# Altium schematic sheet nRF52840.SchDoc
size A3
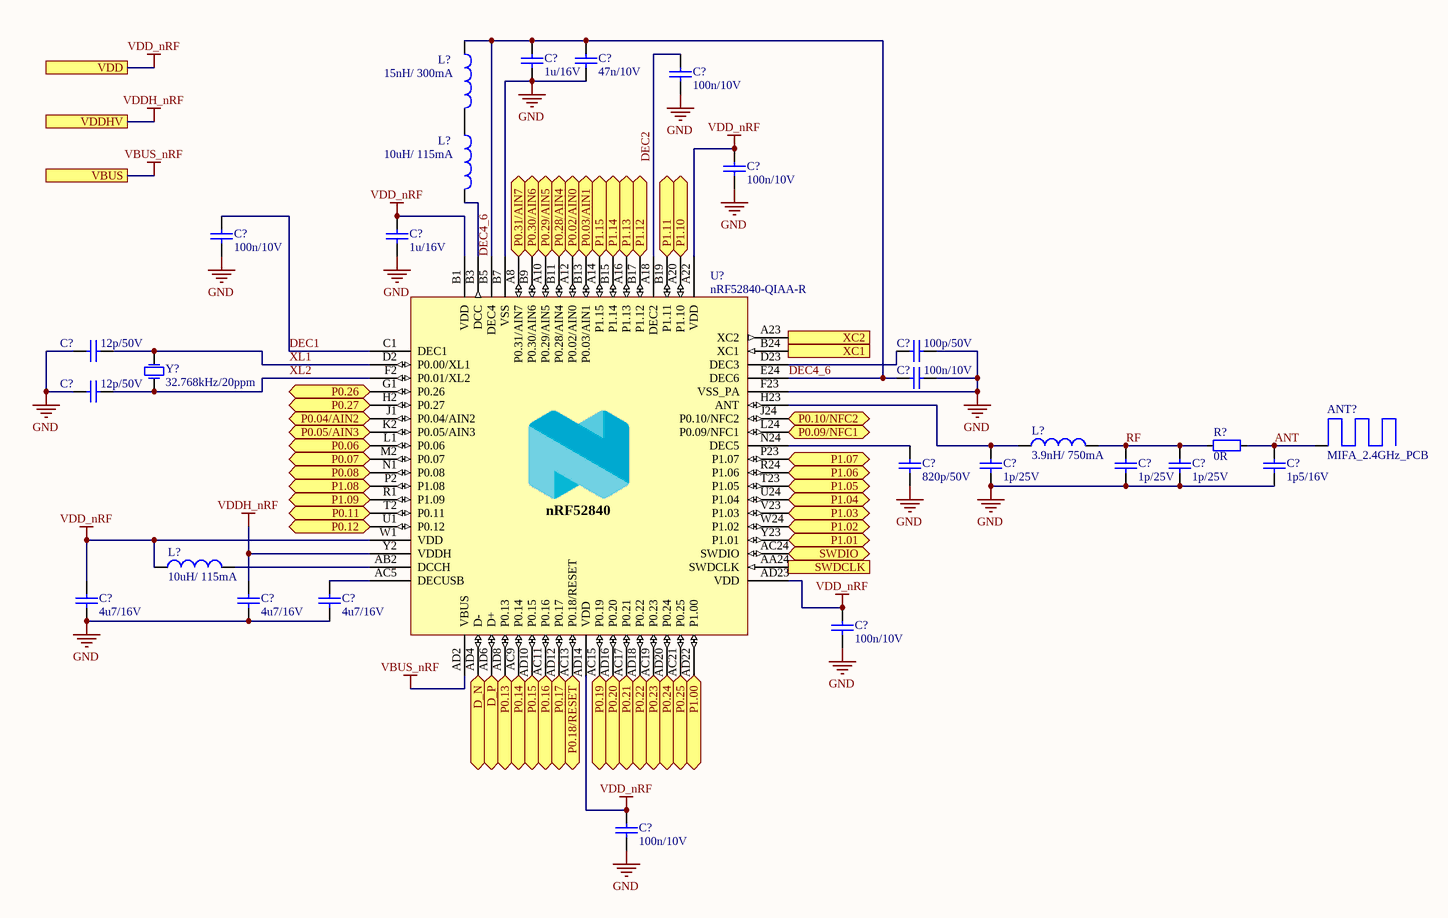
[diagram p0: nRF52840.SchDoc]

## Parts
(Parts that share a designator on the sheet are numbered #1, #2 ... from top to bottom, then left to right.)
ANT?  MIFA_2.4GHz_PCB  [MIFA_2.4GHz_PCB2]  (net tie, no BOM)
C?#1  1u/16V  [C0603]
C?#2  47n/10V  [C0402]
C?#3  100n/10V  [C0402]
C?#4  100n/10V  [C0402]
C?#5  100n/10V  [C0402]
C?#6  1u/16V  [C0603]
C?#7  12p/50V  [C0402]
C?#8  100p/50V  [C0402]
C?#9  100n/10V  [C0402]
C?#10  12p/50V  [C0402]
C?#11  820p/50V  [C0402]
C?#12  1p/25V  [C0402]
C?#13  1p/25V  [C0402]
C?#14  1p/25V  [C0402]
C?#15  1p5/16V  [C0402]
C?#16  4u7/16V  [C0805]
C?#17  4u7/16V  [C0805]
C?#18  4u7/16V  [C0805]
C?#19  100n/10V  [C0402]
C?#20  100n/10V  [C0402]
L?#1  15nH/ 300mA  [L0402]
L?#2  10uH/ 115mA  [L0603]
L?#3  3.9nH/ 750mA  [L0402]
L?#4  10uH/ 115mA  [L0603]
R?  0R  [R0402]
U?  nRF52840-QIAA-R  [AQFN50P700X700X85_HS-74N]
Y?  32.768kHz/20ppm  [CFPX-217]

## Ports
D_N (bidir), D_P (bidir), P0.02/AIN0 (bidir), P0.03/AIN1 (bidir), P0.04/AIN2 (bidir), P0.05/AIN3 (bidir), P0.06 (bidir), P0.07 (bidir), P0.08 (bidir), P0.09/NFC1 (bidir), P0.10/NFC2 (bidir), P0.11 (bidir), P0.12 (bidir), P0.13 (bidir), P0.14 (bidir), P0.15 (bidir), P0.16 (bidir), P0.17 (bidir), P0.18/RESET (bidir), P0.19 (bidir), P0.20 (bidir), P0.21 (bidir), P0.22 (bidir), P0.23 (bidir), P0.24 (bidir), P0.25 (bidir), P0.26 (bidir), P0.27 (bidir), P0.28/AIN4 (bidir), P0.29/AIN5 (bidir), P0.30/AIN6 (bidir), P0.31/AIN7 (bidir), P1.00 (bidir), P1.01 (bidir), P1.02 (bidir), P1.03 (bidir), P1.04 (bidir), P1.05 (bidir), P1.06 (bidir), P1.07 (bidir), P1.08 (bidir), P1.09 (bidir), P1.10 (bidir), P1.11 (bidir), P1.12 (bidir), P1.13 (bidir), P1.14 (bidir), P1.15 (bidir), SWDCLK (in), SWDIO (bidir), VBUS, VDD, VDDHV, XC1 (in), XC2 (out)

## Nets
GND: C?#1.1 C?#2.1 C?#3.1 C?#4.1 C?#5.2 C?#6.1 C?#7.1 C?#8.2 C?#9.1 C?#10.1 C?#11.1 C?#12.1 C?#13.1 C?#14.1 C?#15.1 C?#16.1 C?#17.1 C?#18.1 C?#19.1 C?#20.1 U?.74(GND) U?.B7(VSS) U?.F23(VSS_PA)
VBUS_nRF: U?.AD2(VBUS) ; port VBUS
VDD_nRF: C?#4.2 C?#6.2 C?#16.2 C?#19.2 C?#20.2 L?#4.1 U?.A22(VDD) U?.AD14(VDD) U?.AD23(VDD) U?.B1(VDD) U?.W1(VDD) ; port VDD
VDDH_nRF: C?#17.2 U?.Y2(VDDH) ; port VDDHV
ANT: ANT?.1 C?#15.2 R?.2
D_N: U?.AD4(D-) ; port D_N
D_P: U?.AD6(D+) ; port D_P
DEC1: C?#5.1 U?.C1(DEC1)
DEC2: C?#3.2 U?.A18(DEC2)
DEC4_6: C?#1.2 C?#2.2 C?#9.2 L?#1.1 U?.B5(DEC4) U?.E24(DEC6)
P0.02/AIN0: U?.A12(P0.02/AIN0) ; port P0.02/AIN0
P0.03/AIN1: U?.B13(P0.03/AIN1) ; port P0.03/AIN1
P0.04/AIN2: U?.J1(P0.04/AIN2) ; port P0.04/AIN2
P0.05/AIN3: U?.K2(P0.05/AIN3) ; port P0.05/AIN3
P0.06: U?.L1(P0.06) ; port P0.06
P0.07: U?.M2(P0.07) ; port P0.07
P0.08: U?.N1(P0.08) ; port P0.08
P0.09/NFC1: U?.L24(P0.09/NFC1) ; port P0.09/NFC1
P0.10/NFC2: U?.J24(P0.10/NFC2) ; port P0.10/NFC2
P0.11: U?.T2(P0.11) ; port P0.11
P0.12: U?.U1(P0.12) ; port P0.12
P0.13: U?.AD8(P0.13) ; port P0.13
P0.14: U?.AC9(P0.14) ; port P0.14
P0.15: U?.AD10(P0.15) ; port P0.15
P0.16: U?.AC11(P0.16) ; port P0.16
P0.17: U?.AD12(P0.17) ; port P0.17
P0.18/RESET: U?.AC13(P0.18/RESET) ; port P0.18/RESET
P0.19: U?.AC15(P0.19) ; port P0.19
P0.20: U?.AD16(P0.20) ; port P0.20
P0.21: U?.AC17(P0.21) ; port P0.21
P0.22: U?.AD18(P0.22) ; port P0.22
P0.23: U?.AC19(P0.23) ; port P0.23
P0.24: U?.AD20(P0.24) ; port P0.24
P0.25: U?.AC21(P0.25) ; port P0.25
P0.26: U?.G1(P0.26) ; port P0.26
P0.27: U?.H2(P0.27) ; port P0.27
P0.28/AIN4: U?.B11(P0.28/AIN4) ; port P0.28/AIN4
P0.29/AIN5: U?.A10(P0.29/AIN5) ; port P0.29/AIN5
P0.30/AIN6: U?.B9(P0.30/AIN6) ; port P0.30/AIN6
P0.31/AIN7: U?.A8(P0.31/AIN7) ; port P0.31/AIN7
P1.00: U?.AD22(P1.00) ; port P1.00
P1.01: U?.Y23(P1.01) ; port P1.01
P1.02: U?.W24(P1.02) ; port P1.02
P1.03: U?.V23(P1.03) ; port P1.03
P1.04: U?.U24(P1.04) ; port P1.04
P1.05: U?.T23(P1.05) ; port P1.05
P1.06: U?.R24(P1.06) ; port P1.06
P1.07: U?.P23(P1.07) ; port P1.07
P1.08: U?.P2(P1.08) ; port P1.08
P1.09: U?.R1(P1.09) ; port P1.09
P1.10: U?.A20(P1.10) ; port P1.10
P1.11: U?.B19(P1.11) ; port P1.11
P1.12: U?.B17(P1.12) ; port P1.12
P1.13: U?.A16(P1.13) ; port P1.13
P1.14: U?.B15(P1.14) ; port P1.14
P1.15: U?.A14(P1.15) ; port P1.15
RF: C?#13.2 C?#14.2 L?#3.2 R?.1
SWDCLK: U?.AA24(SWDCLK) ; port SWDCLK
SWDIO: U?.AC24(SWDIO) ; port SWDIO
XC1: U?.B24(XC1) ; port XC1
XC2: U?.A23(XC2) ; port XC2
XL1: C?#7.2 U?.D2(P0.00/XL1) Y?.2
XL2: C?#10.2 U?.F2(P0.01/XL2) Y?.1
NetC?#8_1: C?#8.1 U?.D23(DEC3)
NetC?#11_2: C?#11.2 U?.N24(DEC5)
NetC?#12_2: C?#12.2 L?#3.1 U?.H23(ANT)
NetC?#18_2: C?#18.2 U?.AC5(DECUSB)
NetL?#1_2: L?#1.2 L?#2.1
NetL?#2_2: L?#2.2 U?.B3(DCC)
NetL?#4_2: L?#4.2 U?.AB2(DCCH)

## Notes on the sheet
- Title
- Date:
- Number:
- Revision:
- Sheet
- of
- File:
- Author
- (in symbol nRF52840_QIAA) nRF52840

## Library data of the parts
ANT? = MIFA_2.4GHz_PCB2: Meandered Inverted-F Antenna (MIFA)
C?#1 C?#6 = 1u 16V X7R 0603: Manufacturer Part Number 1: 885012206052; Manufacturer 1: Wurth Elektronik; Voltage: 16V; Tolerance: 10%; Specifications: X7R 1u 16V ±10%; Capacitance: 1u; Dielectric: X7R; Supplier 1: Mouser; Supplier Part Number 1: 710-885012206052
C?#2 = 47n 10V Y5V 0402: Manufacturer Part Number 1: 0402F474Z100CT; Manufacturer 1: Walsin; Voltage: 10V; Tolerance: 20%; Specifications: Y5V 47n 10V ±20%; Capacitance: 47n; Dielectric: Y5V; Supplier 1: Farnell; Supplier Part Number 1: 2524745
C?#3-C?#5 C?#9 C?#19 C?#20 = 100n 10V X5R 0402: Manufacturer Part Number 1: 885012105010; Manufacturer 1: Wurth Elektronik; Voltage: 10V; Tolerance: 20%; Specifications: X5R 100n 10V ±20%; Capacitance: 100n; Dielectric: X5R; Supplier 1: Mouser; Supplier Part Number 1: 710-885012105010
C?#7 C?#10 = 12p 50V NPO 0402: Manufacturer Part Number 1: CC0402JRNPO9BN120; Manufacturer 1: Yageo; Voltage: 50V; Tolerance: 5%; Specifications: NPO 12p 50V ±5%; Capacitance: 12p; Dielectric: NPO; Supplier 1: Mouser; Supplier Part Number 1: 603-CC402JRNPO9BN120
C?#8 = 100p 50V C0G 0402: Manufacturer Part Number 1: MC0402N101K500CT; Manufacturer 1: Multicomp PRO; Voltage: 50V; Tolerance: 10%; Specifications: C0G 100p 50V ±10%; Capacitance: 100p; Dielectric: C0G; Supplier 1: Farnell; Supplier Part Number 1: 2320762
C?#11 = 820p 50V X7R 0402: Manufacturer Part Number 1: MC0402B821K500CT; Manufacturer 1: Multicomp PRO; Voltage: 50V; Tolerance: 10%; Specifications: X7R 820p 50V ±10%; Capacitance: 820p; Dielectric: X7R; Supplier 1: Farnell; Supplier Part Number 1: 1758990
C?#12-C?#14 = 1p 25V C0G 0402: Manufacturer Part Number 1: 885012005034; Manufacturer 1: Wurth Elektronik; Voltage: 25V; Tolerance: 0.5pF; Specifications: C0G 1p 25V ±0.5pF; Capacitance: 1p; Dielectric: C0G; Supplier 1: Farnell; Supplier Part Number 1: 2533789
C?#15 = 1p5 1V C0G 0402: Manufacturer Part Number 1: 885012005020; Manufacturer 1: Wurth Elektronik; Voltage: 16V; Tolerance: 0.5pF; Specifications: C0G 1p5 16V ±0.5pF; Capacitance: 1p5; Dielectric: C0G; Supplier 1: Farnell; Supplier Part Number 1: 2812064
C?#16-C?#18 = 4u7 16V X7R 0805: Manufacturer Part Number 1: EMK212AB7475KGHT; Manufacturer 1: Taiyo Yuden; Voltage: 16V; Tolerance: 10%; Specifications: X7R 4u7 16V ±10%; Capacitance: 4u7; Dielectric: X7R; Supplier 1: Mouser; Supplier Part Number 1: 963-EMK212AB7475KGHT
L?#1 = HK100515NJ-T: Fixed Inductors 0402 15nH 460mOhms +/-5%Tol 300mA HiQ; Manufacturer 1: Taiyo Yuden; Tolerance: 5%; Specifications: 15nH 300mA 5%; ComponentLink1Description: Datasheet; ComponentLink1URL: https://www.mouser.co.uk/datasheet/2/396/mlci04_e-1396612.pdf; Inductance: 15nH; Current: 300mA; Manufacturer Part Number 1: HK100515NJ-T; Supplier 1: Mouser; Supplier Part Number 1: 963-HK100515NJ-T
L?#2 L?#4 = L0603B100KDWFT: Fixed Inductors 10uH 10% Wound Chip; Manufacturer 1: Kemet; Specifications: 10uH 115mA 10%; ComponentLink1Description: Datasheet; ComponentLink1URL: https://www.mouser.co.uk/datasheet/2/212/F3115-1104303.pdf; Inductance: 10uH; Tolerance: 10%; Current: 115mA; Manufacturer Part Number 1: L0603B100KDWFT; Supplier 1: Mouser; Supplier Part Number 1: 80-L0603B100KDWFT
L?#3 = LQG15HS3N9C02D: Fixed Inductors 0402 3.9nH 0.2nH 750mA .14ohms 6.0GHz; Manufacturer 1: Murata Electronics; Specifications: 3.9nH 750mA 0.2nH; ComponentLink1Description: Datasheet; ComponentLink1URL: https://www.mouser.co.uk/datasheet/2/281/JELF243B-0010-1699614.pdf; Inductance: 3.9nH; Tolerance: 0.2nH; Current: 750mA; Manufacturer Part Number 1: LQG15HS3N9C02D; Supplier 1: Mouser; Supplier Part Number 1: 81-LQG15HS3N9C02D
R? = 0R 63mW 50V 0402: Manufacturer Part Number 1: CRCW04020000Z0EDC; Manufacturer 1: Vishay; Power Rating: 63mW; Tolerance: 1%; Voltage: 50V; Resistance: 0R; Specifications: =Resistance+ ' '+"Power Rating "+Voltage+' ±'+Tolerance; Supplier 1: Mouser; Supplier Part Number 1: 71-CRCW04020000Z0EDC
U? = nRF52840_QIAA: Multi-protocol Bluetooth Low Energy, IEEE 802.15.4, ANT and 2.4GHz proprietary system-on-chip; Manufacturer 1: Nordic Semiconductor; Manufacturer Part Number 1: nRF52840-QIAA-R; ComponentLink1URL: https://www.mouser.co.uk/datasheet/2/297/nRF52840_PS_v1.1-1623672.pdf; ComponentLink1Description: Datasheet; Supplier 1: Mouser; Supplier Part Number 1: 949-NRF52840-QIAA-R
Y? = LFXTAL009706Bulk: Manufacturer 1: IQD; Tolerance: 20ppm; Load Capacitance: 9pF; Specifications: 32.768kHz  9pF 20ppm; Frequency: 32.768kHz; Manufacturer Part Number 1: LFXTAL009706Bulk; ComponentLink1Description: Datasheets; ComponentLink1URL: https://www.mouser.co.uk/datasheet/2/741/LFXTAL009706Bulk-940434.pdf; Supplier 1: Mouser; Supplier Part Number 1: 449-LFXTAL009706BULK